# Altium schematic sheet schematic.SchDoc
size A4; SheetNumber: 6; SheetTotal: 29
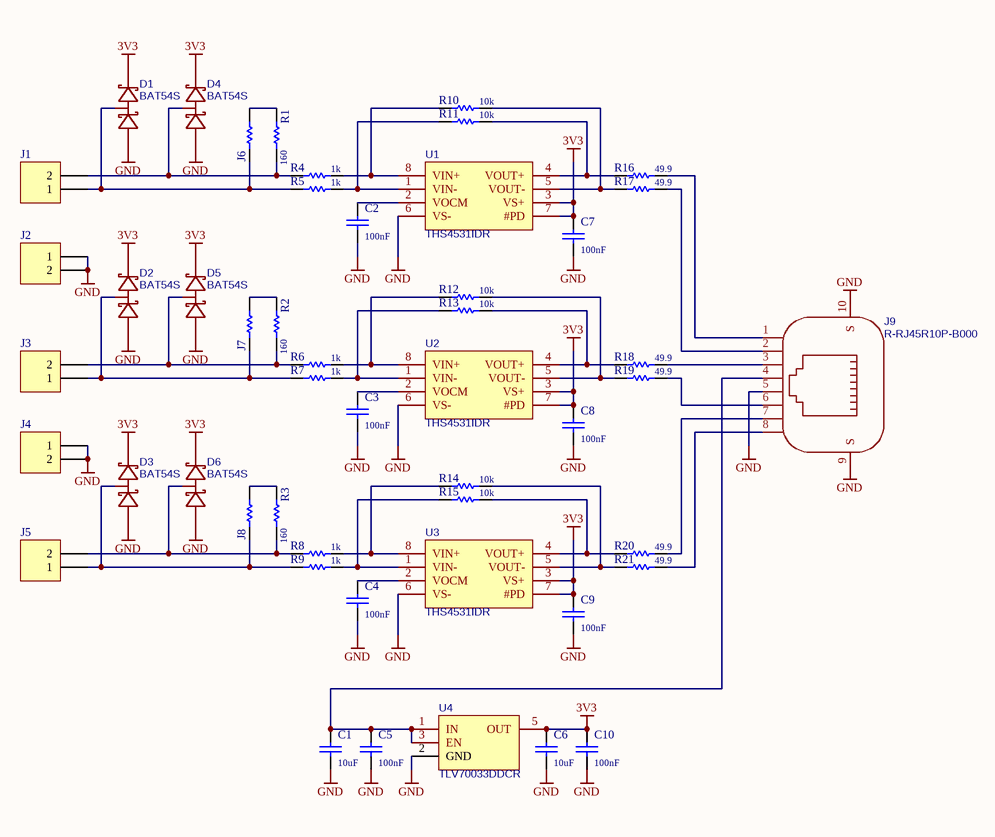
[diagram p0: schematic.SchDoc]

## Parts
C1  10uF  [C0805]
C2  100nF  [C0603]
C3  100nF  [C0603]
C4  100nF  [C0603]
C5  100nF  [C0603]
C6  10uF  [C0805]
C7  100nF  [C0603]
C8  100nF  [C0603]
C9  100nF  [C0603]
C10  100nF  [C0603]
D1  BAT54S  [SOT-23]
D2  BAT54S  [SOT-23]
D3  BAT54S  [SOT-23]
D4  BAT54S  [SOT-23]
D5  BAT54S  [SOT-23]
D6  BAT54S  [SOT-23]
J1  DG308-2.54-02P-14-00A(H)  [CONN_DG308-2.54-2P]  (value not drawn)
J2  DG308-2.54-02P-14-00A(H)  [CONN_DG308-2.54-2P]  (value not drawn)
J3  DG308-2.54-02P-14-00A(H)  [CONN_DG308-2.54-2P]  (value not drawn)
J4  DG308-2.54-02P-14-00A(H)  [CONN_DG308-2.54-2P]  (value not drawn)
J5  DG308-2.54-02P-14-00A(H)  [CONN_DG308-2.54-2P]  (value not drawn)
J6  undef  [R0603]  (value not drawn)
J7  undef  [R0603]  (value not drawn)
J8  undef  [R0603]  (value not drawn)
J9  R-RJ45R10P-B000  [RJ45-TH_R-RJ45R10P-B000]
R1  160  [R0603]
R2  160  [R0603]
R3  160  [R0603]
R4  1k  [R0603]
R5  1k  [R0603]
R6  1k  [R0603]
R7  1k  [R0603]
R8  1k  [R0603]
R9  1k  [R0603]
R10  10k  [R0603]
R11  10k  [R0603]
R12  10k  [R0603]
R13  10k  [R0603]
R14  10k  [R0603]
R15  10k  [R0603]
R16  49.9  [R0603]
R17  49.9  [R0603]
R18  49.9  [R0603]
R19  49.9  [R0603]
R20  49.9  [R0603]
R21  49.9  [R0603]
U1  THS4531IDR  [SO-8]
U2  THS4531IDR  [SO-8]
U3  THS4531IDR  [SO-8]
U4  TLV70033DDCR  [SOT-23-5]

## Nets
3V3: C6.2 C7.2 C8.2 C9.2 C10.2 D1.2(K) D2.2(K) D3.2(K) D4.2(K) D5.2(K) D6.2(K) U1.3(VS+) U1.7(#PD) U2.3(VS+) U2.7(#PD) U3.3(VS+) U3.7(#PD) U4.5(OUT)
GND: C1.1 C2.1 C3.1 C4.1 C5.1 C6.1 C7.1 C8.1 C9.1 C10.1 D1.1(A) D2.1(A) D3.1(A) D4.1(A) D5.1(A) D6.1(A) J2.1 J2.2 J4.1 J4.2 J9.5 J9.9(S) J9.10(S) U1.6(VS-) U2.6(VS-) U3.6(VS-) U4.2(GND)
NetC1_2: C1.2 C5.2 J9.4 U4.1(IN) U4.3(EN)
NetC2_2: C2.2 U1.2(VOCM)
NetC3_2: C3.2 U2.2(VOCM)
NetC4_2: C4.2 U3.2(VOCM)
NetD1_3: D1.3 J1.1 J6.1 R5.1
NetD2_3: D2.3 J3.1 J7.1 R7.1
NetD3_3: D3.3 J5.1 J8.1 R9.1
NetD4_3: D4.3 J1.2 R1.2 R4.1
NetD5_3: D5.3 J3.2 R2.2 R6.1
NetD6_3: D6.3 J5.2 R3.2 R8.1
NetJ6_2: J6.2 R1.1
NetJ7_2: J7.2 R2.1
NetJ8_2: J8.2 R3.1
NetJ9_1: J9.1 R16.2
NetJ9_2: J9.2 R17.2
NetJ9_3: J9.3 R18.2
NetJ9_6: J9.6 R19.2
NetJ9_7: J9.7 R20.2
NetJ9_8: J9.8 R21.2
NetR4_2: R4.2 R10.1 U1.8(VIN+)
NetR5_2: R5.2 R11.1 U1.1(VIN-)
NetR6_2: R6.2 R12.1 U2.8(VIN+)
NetR7_2: R7.2 R13.1 U2.1(VIN-)
NetR8_2: R8.2 R14.1 U3.8(VIN+)
NetR9_2: R9.2 R15.1 U3.1(VIN-)
NetR10_2: R10.2 R17.1 U1.5(VOUT-)
NetR11_2: R11.2 R16.1 U1.4(VOUT+)
NetR12_2: R12.2 R19.1 U2.5(VOUT-)
NetR13_2: R13.2 R18.1 U2.4(VOUT+)
NetR14_2: R14.2 R21.1 U3.5(VOUT-)
NetR15_2: R15.2 R20.1 U3.4(VOUT+)

## Library data of the parts
C1 C6 = CAP: 10uf 50V 1206
C2-C5 C7-C10 = CAP: 100nF 0603
D1-D6 = BAT54S_C916425
J1-J5 = CONN MOLEX HDR-M 1x4
J6-J8 = R0201
R1-R3 = R0201: 160R 0603
R4-R9 = R0201: 1k 0603
R10-R15 = R0201: 10k 0603
R16-R21 = R0201: 49.9R